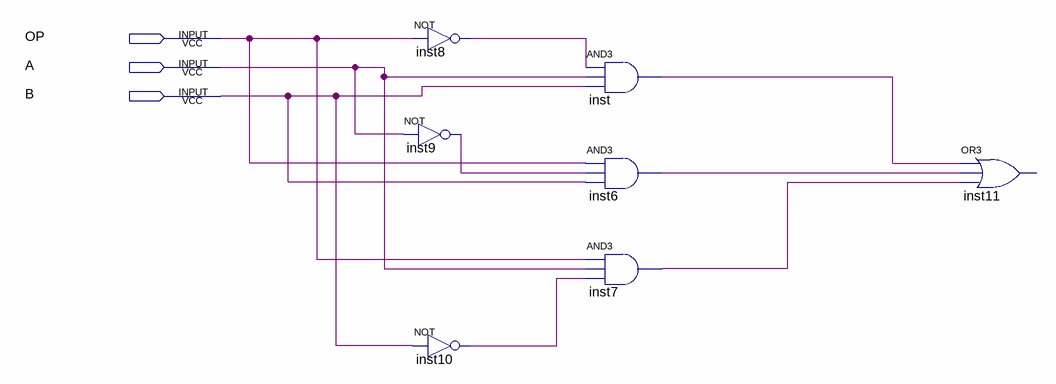
[diagram p0: schematic sheet]
// Quartus schematic And_Xor_Bit.bdf as structural Verilog: 7 symbols, 3 pins
module And_Xor_Bit (
  input  OP,
  input  A,
  input  B
);

  wire inst6_out, inst7_out, inst8_out, inst9_out, inst10_out, inst_out;

  not inst8 (inst8_out, OP);
  not inst9 (inst9_out, A);
  not inst10 (inst10_out, B);
  and inst (inst_out, inst8_out, A, B);
  and inst6 (inst6_out, OP, inst9_out, B);
  and inst7 (inst7_out, OP, A, inst10_out);
  // OR3 inst11 has open pins: IN1=inst_out, IN2=inst6_out, IN3=inst7_out, OUT=open
endmodule
